# EAGLE schematic board (EAGLE 7.3.0)
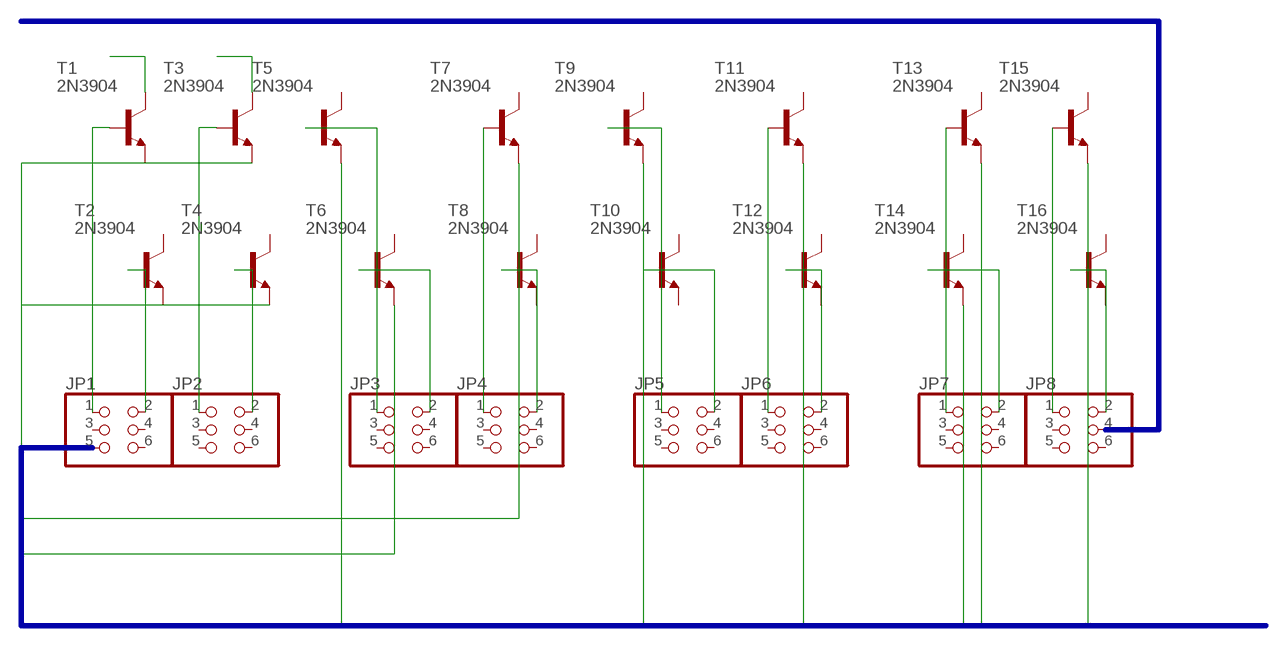
[diagram p0: schematic, sheet 1]

## Parts
JP1  PINHD-2X3  [2X03]
JP2  PINHD-2X3  [2X03]
JP3  PINHD-2X3  [2X03]
JP4  PINHD-2X3  [2X03]
JP5  PINHD-2X3  [2X03]
JP6  PINHD-2X3  [2X03]
JP7  PINHD-2X3  [2X03]
JP8  PINHD-2X3  [2X03]
T1  2N3904  [TO92]
T2  2N3904  [TO92]
T3  2N3904  [TO92]
T4  2N3904  [TO92]
T5  2N3904  [TO92]
T6  2N3904  [TO92]
T7  2N3904  [TO92]
T8  2N3904  [TO92]
T9  2N3904  [TO92]
T10  2N3904  [TO92]
T11  2N3904  [TO92]
T12  2N3904  [TO92]
T13  2N3904  [TO92]
T14  2N3904  [TO92]
T15  2N3904  [TO92]
T16  2N3904  [TO92]

## Nets
B$1: T1.3(E) T3.3(E) T4.3(E) T5.3(E) T6.3(E) T7.3(E) T9.3(E) T11.3(E) T13.3(E) T14.3(E) T15.3(E)
N$1: JP1.1 T1.2(B)
N$2: JP1.2 T2.2(B)
N$3: JP2.1 T3.2(B)
N$4: JP2.2 T4.2(B)
N$5: JP3.1 T5.2(B)
N$6: JP3.2 T6.2(B)
N$7: JP4.1 T7.2(B)
N$8: JP4.2 T8.2(B)
N$9: JP5.1 T9.2(B)
N$10: JP5.2 T10.2(B)
N$11: JP6.1 T11.2(B)
N$12: JP6.2 T12.2(B)
N$13: JP7.1 T13.2(B)
N$14: JP7.2 T14.2(B)
N$15: JP8.1 T15.2(B)
N$16: JP8.2 T16.2(B)
N$17: T1.1(C)
N$18: T3.1(C)
Unconnected: JP1.3 JP1.4 JP1.5 JP1.6 JP2.3 JP2.4 JP2.5 JP2.6 JP3.3 JP3.4 JP3.5 JP3.6 JP4.3 JP4.4 JP4.5 JP4.6 JP5.3 JP5.4 JP5.5 JP5.6 JP6.3 JP6.4 JP6.5 JP6.6 JP7.3 JP7.4 JP7.5 JP7.6 JP8.3 JP8.4 JP8.5 JP8.6 T2.1(C) T2.3(E) T4.1(C) T5.1(C) T6.1(C) T7.1(C) T8.1(C) T8.3(E) T9.1(C) T10.1(C) T10.3(E) T11.1(C) T12.1(C) T12.3(E) T13.1(C) T14.1(C) T15.1(C) T16.1(C) T16.3(E)

## Buses
B$1
B$2

## Library data of the parts
JP1-JP8 = SparkFun-Connectors:PINHD-2X3: PIN HEADER
T1-T16 = transistor:2N3904: NPN TRANSISTOR